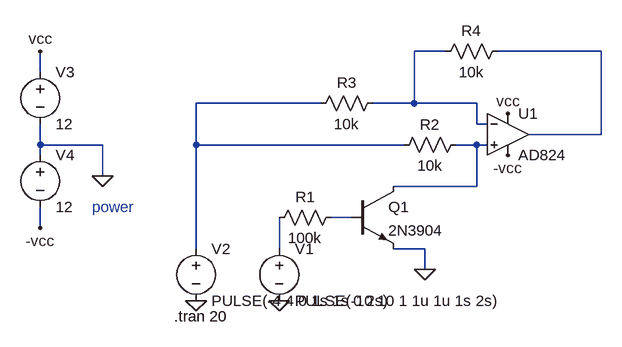
[diagram p0: schematic Saw Tooth 2.asc]
Saw Tooth 2.asc, the LTspice schematic file:
Version 4
SHEET 1 880 680
WIRE 512 -176 464 -176
WIRE 752 -176 592 -176
WIRE -112 -144 -112 -176
WIRE 320 -96 128 -96
WIRE 464 -96 464 -176
WIRE 464 -96 400 -96
WIRE 560 -96 464 -96
WIRE 560 -64 560 -96
WIRE 576 -64 560 -64
WIRE 752 -48 752 -176
WIRE 752 -48 640 -48
WIRE -112 -32 -112 -64
WIRE -16 -32 -112 -32
WIRE 128 -32 128 -96
WIRE 448 -32 128 -32
WIRE 560 -32 528 -32
WIRE 576 -32 560 -32
WIRE -112 -16 -112 -32
WIRE -16 16 -16 -32
WIRE 560 32 560 -32
WIRE 560 32 432 32
WIRE 368 80 336 80
WIRE -112 96 -112 64
WIRE 128 128 128 -32
WIRE 256 128 256 80
WIRE 480 128 432 128
WIRE 480 160 480 128
FLAG 480 160 0
FLAG 256 208 0
FLAG 128 208 0
FLAG -112 -176 vcc
FLAG -112 96 -vcc
FLAG -16 16 0
FLAG 608 -80 vcc
FLAG 608 -16 -vcc
SYMBOL voltage 256 112 R0
WINDOW 123 0 0 Left 0
WINDOW 39 0 0 Left 0
SYMATTR InstName V1
SYMATTR Value PULSE(-10 10 1 1u 1u 1s 2s)
SYMBOL voltage 128 112 R0
WINDOW 123 0 0 Left 0
WINDOW 39 0 0 Left 0
SYMATTR InstName V2
SYMATTR Value PULSE(-4 4 0 1s 1s 0 2s)
SYMBOL npn 368 32 R0
SYMATTR InstName Q1
SYMATTR Value 2N3904
SYMBOL res 352 64 R90
WINDOW 0 0 56 VBottom 2
WINDOW 3 32 56 VTop 2
SYMATTR InstName R1
SYMATTR Value 100k
SYMBOL OpAmps\\AD824 608 -112 R0
SYMATTR InstName U1
SYMBOL res 544 -48 R90
WINDOW 0 0 56 VBottom 2
WINDOW 3 32 56 VTop 2
SYMATTR InstName R2
SYMATTR Value 10k
SYMBOL res 416 -112 R90
WINDOW 0 0 56 VBottom 2
WINDOW 3 32 56 VTop 2
SYMATTR InstName R3
SYMATTR Value 10k
SYMBOL res 608 -192 R90
WINDOW 0 0 56 VBottom 2
WINDOW 3 32 56 VTop 2
SYMATTR InstName R4
SYMATTR Value 10k
SYMBOL voltage -112 -160 R0
WINDOW 123 0 0 Left 0
WINDOW 39 0 0 Left 0
SYMATTR InstName V3
SYMATTR Value 12
SYMBOL voltage -112 -32 R0
WINDOW 123 0 0 Left 0
WINDOW 39 0 0 Left 0
SYMATTR InstName V4
SYMATTR Value 12
TEXT 94 232 Left 2 !.tran 20
TEXT -32 64 Left 2 ;power

The netlist it stands for:
* Saw Tooth 2.asc
V1 N006 0 PULSE(-10 10 1 1u 1u 1s 2s)
V2 N003 0 PULSE(-4 4 0 1s 1s 0 2s)
Q1 N004 N005 0 0 2N3904
R1 N005 N006 100k
XU1 N004 N001 vcc -vcc N002 AD824  ; pins In+ In- V+ V- OUT
R2 N004 N003 10k
R3 N001 N003 10k
R4 N002 N001 10k
V3 vcc 0 12
V4 0 -vcc 12
.model NPN NPN
.model PNP PNP
.lib standard.bjt
.tran 20
* power
.backanno
.end